# EAGLE schematic schematic (EAGLE 9.6.2)
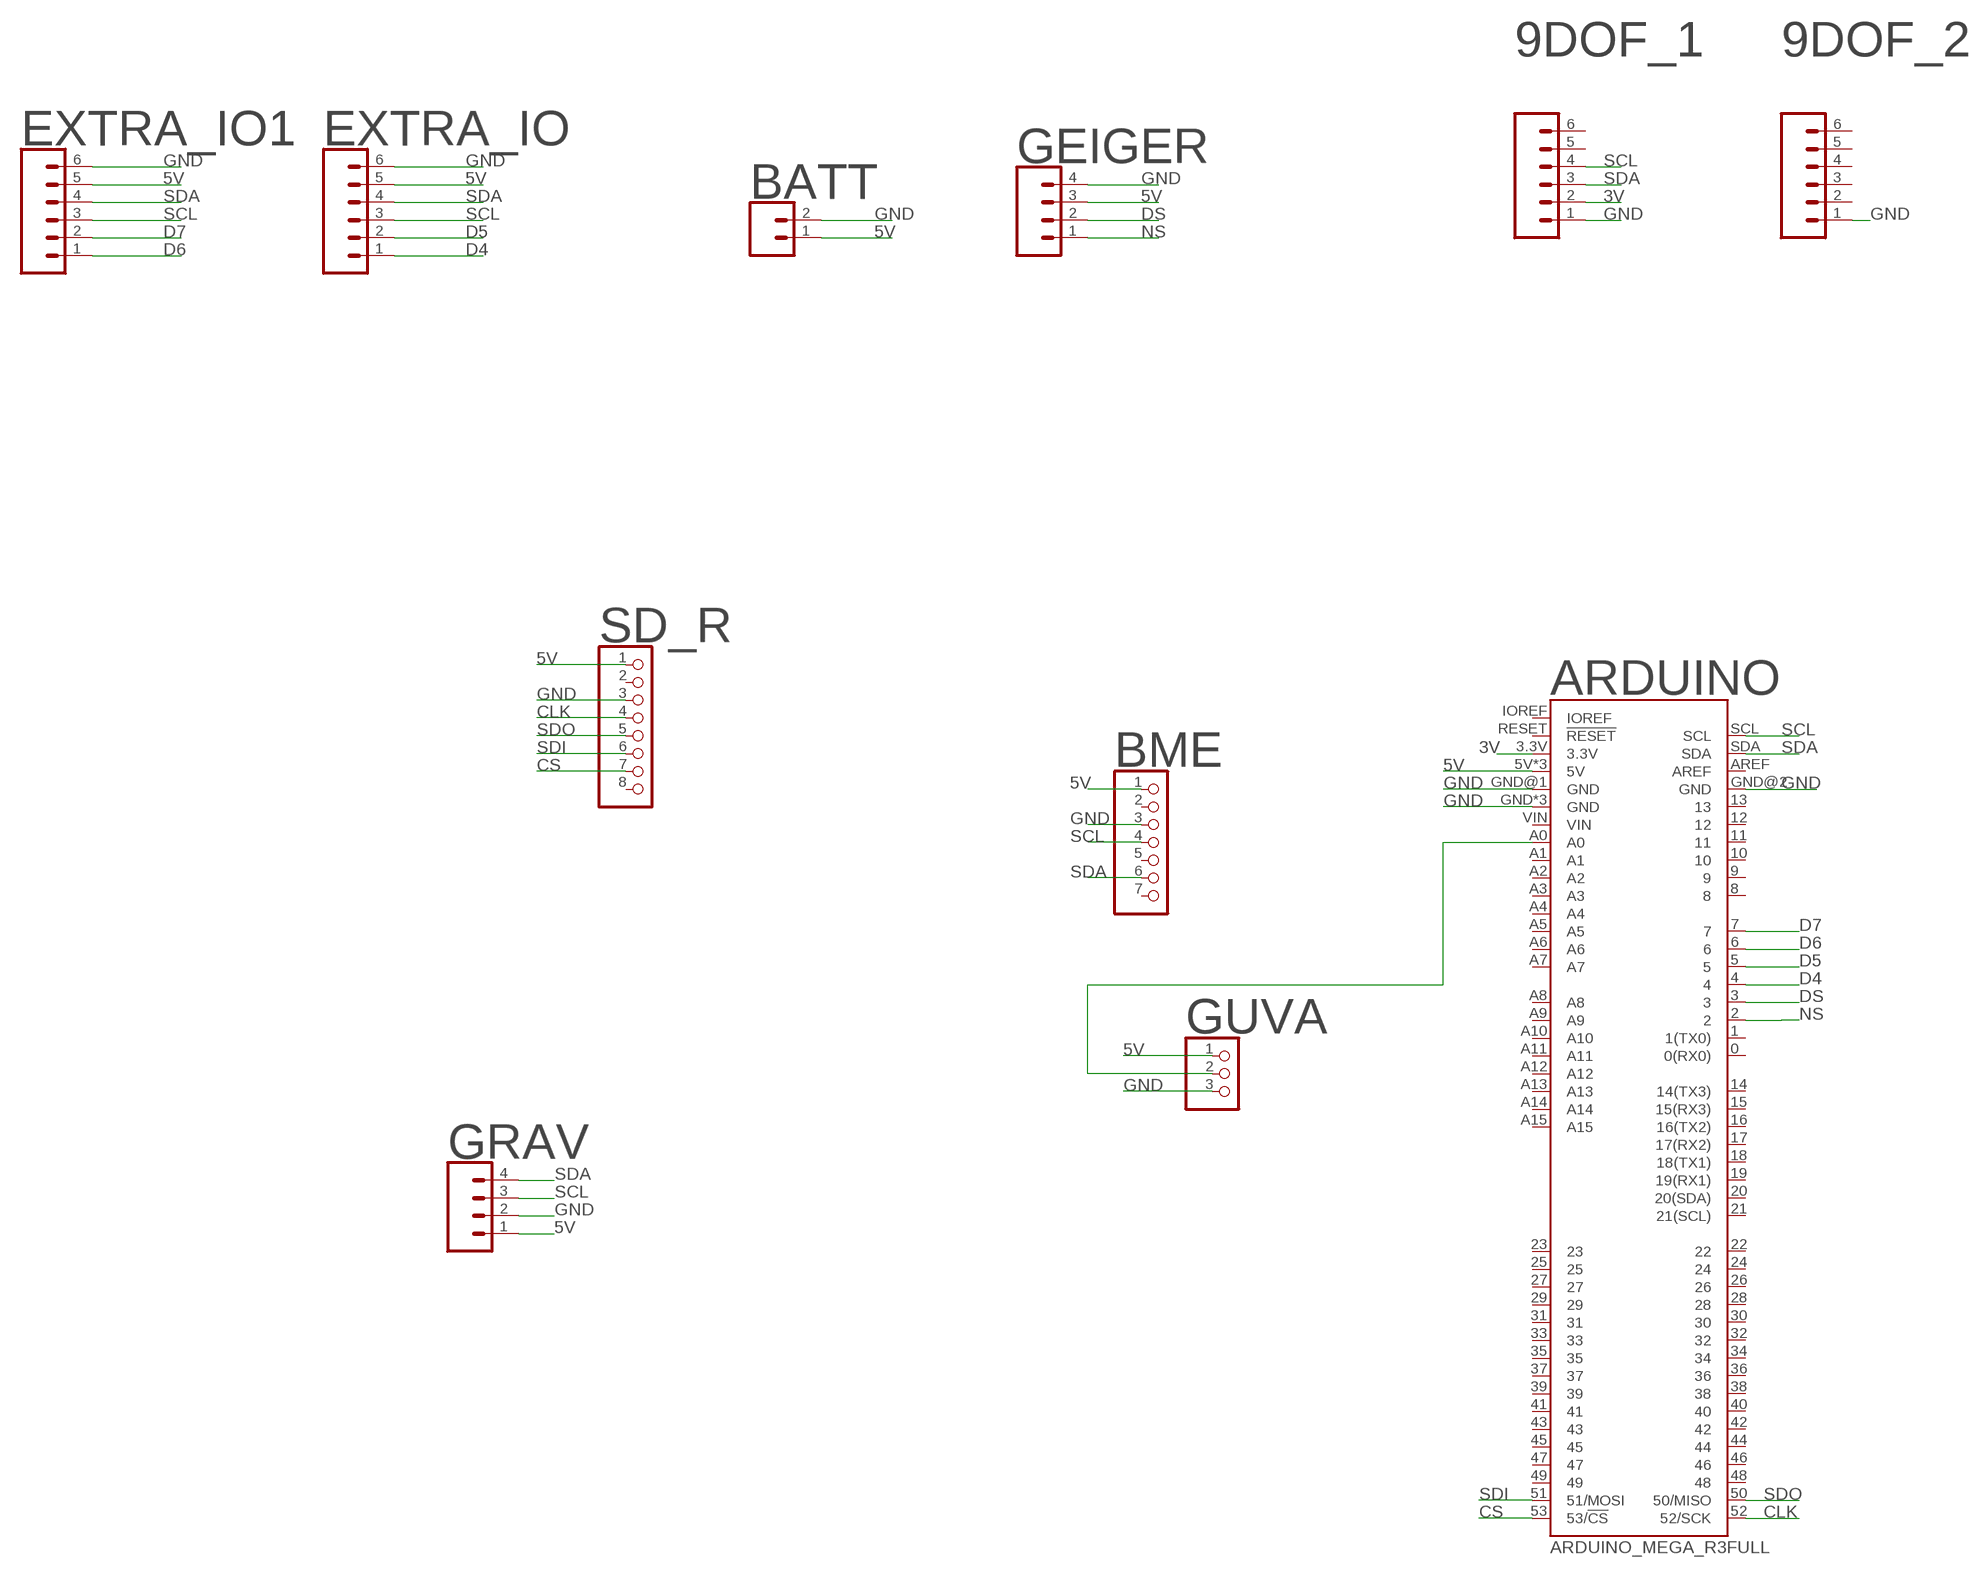
[diagram p0: schematic, sheet 1]

## Parts
9DOF_1  CONN_06NO_SILK_NO_POP  [1X06_NO_SILK]
9DOF_2  CONN_06NO_SILK_NO_POP  [1X06_NO_SILK]
ARDUINO  ARDUINO_MEGA_R3FULL  [ARDUINO_MEGA_NO_SILK]
BATT  CONN_02  [1X02]
BME  HEADER-1X770MIL  [1X07_ROUND_70]
EXTRA_IO  CONN_06SILK_FEMALE_PTH  [1X06]
EXTRA_IO1  CONN_06SILK_FEMALE_PTH  [1X06]
GEIGER  CONN_04PTH  [1X04]
GRAV  CONN_04LOCK  [1X04_LOCK]
GUVA  PINHD-1X3CB  [1X03-CLEANBIG]
SD_R  PINHD-1X8BIG  [1X08-BIG]

## Nets
3V: 9DOF_1.2 ARDUINO.3.3V
5V: ARDUINO.5V ARDUINO.5V@1(5V) ARDUINO.5V@2(5V) BATT.1 BME.1 EXTRA_IO1.5 EXTRA_IO.5 GEIGER.3 GRAV.1 GUVA.1 SD_R.1
CLK: ARDUINO.52(52/SCK) SD_R.4
CS: ARDUINO.53(53/!CS) SD_R.7
D4: ARDUINO.4 EXTRA_IO.1
D5: ARDUINO.5 EXTRA_IO.2
D6: ARDUINO.6 EXTRA_IO1.1
D7: ARDUINO.7 EXTRA_IO1.2
DS: ARDUINO.3 GEIGER.2
GND: 9DOF_1.1 9DOF_2.1 ARDUINO.GND ARDUINO.GND@1(GND) ARDUINO.GND@2(GND) ARDUINO.GND@3(GND) ARDUINO.GND@4(GND) BATT.2 BME.3 EXTRA_IO1.6 EXTRA_IO.6 GEIGER.4 GRAV.2 GUVA.3 SD_R.3
N$1: ARDUINO.A0 GUVA.2
NS: ARDUINO.2 GEIGER.1
SCL: 9DOF_1.4 ARDUINO.SCL BME.4 EXTRA_IO1.3 EXTRA_IO.3 GRAV.3
SDA: 9DOF_1.3 ARDUINO.SDA BME.6 EXTRA_IO1.4 EXTRA_IO.4 GRAV.4
SDI: ARDUINO.51(51/MOSI) SD_R.6
SDO: ARDUINO.50(50/MISO) SD_R.5
Unconnected: 9DOF_1.5 9DOF_1.6 9DOF_2.2 9DOF_2.3 9DOF_2.4 9DOF_2.5 9DOF_2.6 ARDUINO.0(0(RX0)) ARDUINO.1(1(TX0)) ARDUINO.8 ARDUINO.9 ARDUINO.10 ARDUINO.11 ARDUINO.12 ARDUINO.13 ARDUINO.14(14(TX3)) ARDUINO.15(15(RX3)) ARDUINO.16(16(TX2)) ARDUINO.17(17(RX2)) ARDUINO.18(18(TX1)) ARDUINO.19(19(RX1)) ARDUINO.20(20(SDA)) ARDUINO.21(21(SCL)) ARDUINO.22 ARDUINO.23 ARDUINO.24 ARDUINO.25 ARDUINO.26 ARDUINO.27 ARDUINO.28 ARDUINO.29 ARDUINO.30 ARDUINO.31 ARDUINO.32 ARDUINO.33 ARDUINO.34 ARDUINO.35 ARDUINO.36 ARDUINO.37 ARDUINO.38 ARDUINO.39 ARDUINO.40 ARDUINO.41 ARDUINO.42 ARDUINO.43 ARDUINO.44 ARDUINO.45 ARDUINO.46 ARDUINO.47 ARDUINO.48 ARDUINO.49 ARDUINO.A1 ARDUINO.A2 ARDUINO.A3 ARDUINO.A4 ARDUINO.A5 ARDUINO.A6 ARDUINO.A7 ARDUINO.A8 ARDUINO.A9 ARDUINO.A10 ARDUINO.A11 ARDUINO.A12 ARDUINO.A13 ARDUINO.A14 ARDUINO.A15 ARDUINO.AREF ARDUINO.IOREF ARDUINO.RESET(!RESET) ARDUINO.VIN BME.2 BME.5 BME.7 SD_R.2 SD_R.8

## Library data of the parts
9DOF_1 9DOF_2 = SparkFun-Connectors:CONN_06: Multi connection point. Often used as Generic Header-pin footprint for 0.1 inch spaced/style header connections On any of the 0.1 inch spaced packages, you can populate with these: Break Away Headers - Straight <https://www.sparkfun.com/products/116> (PRT-00116) Break Away Male Headers - Right Angle <https://www.sparkfun.com/products/553> (PRT-00553) Female Headers <https://www.sparkfun.com/products/115> (PRT-00115) Break Away Headers - Machine Pin <https://www.sparkfun.com/products/117> (PRT-00117) Break Away Female Headers - Swiss Machine Pin <https://www.sparkfun.com/products/743> (PRT-00743) Arduino Stackable Header - 6 Pin <https://www.sparkfun.com/products/9280> (PRT-09280) For SCREWTERMINALS and SPRING TERMINALS visit here: Screw Terimnals on SparkFun.com <https://www.sparkfun.com/search/results?term=Screw+Terminals> (5mm/3.5mm/2.54mm spacing) This device is also useful as a general connection point to wire up your design to another part of your project. Our various solder wires solder well into these plated through hole pads. Hook-Up Wire - Assortment (Stranded, 22 AWG) <https://www.sparkfun.com/products/11375> (PRT-11375) Hook-Up Wire - Assortment (Solid Core, 22 AWG) <https://www.sparkfun.com/products/11367> (PRT-11367) View the entire wire category on our website here <https://www.sparkfun.com/categories/141>
ARDUINO = SparkFun-Boards:ARDUINO_MEGA_R3: Arduino Mega R3 ATmega2560 R3 compatible footprint. SparkFun Products: Arduino Mega 2560 R3 <https://www.sparkfun.com/products/11061>
BATT = SparkFun-Connectors:CONN_02: Multi connection point. Often used as Generic Header-pin footprint for 0.1 inch spaced/style header connections On any of the 0.1 inch spaced packages, you can populate with these: Break Away Headers - Straight <https://www.sparkfun.com/products/116> (PRT-00116) Break Away Male Headers - Right Angle <https://www.sparkfun.com/products/553> (PRT-00553) Female Headers <https://www.sparkfun.com/products/115> (PRT-00115) Break Away Headers - Machine Pin <https://www.sparkfun.com/products/117> (PRT-00117) Break Away Female Headers - Swiss Machine Pin <https://www.sparkfun.com/products/743> (PRT-00743) For SCREWTERMINALS and SPRING TERMINALS visit here: Screw Terimnals on SparkFun.com <https://www.sparkfun.com/search/results?term=Screw+Terminals> (5mm/3.5mm/2.54mm spacing) This device is also useful as a general connection point to wire up your design to another part of your project. Our various solder wires solder well into these plated through hole pads. Hook-Up Wire - Assortment (Stranded, 22 AWG) <https://www.sparkfun.com/products/11375> (PRT-11375) Hook-Up Wire - Assortment (Solid Core, 22 AWG) <https://www.sparkfun.com/products/11367> (PRT-11367) View the entire wire category on our website here <https://www.sparkfun.com/categories/141> Special notes: Molex polarized connector foot print use with: PRT-08233 with associated crimp pins and housings. 2.54_SCREWTERM for use with PRT-10571. 3.5mm Screw Terminal footprints for PRT-08084 5mm Screw Terminal footprints for use with PRT-08432
BME = microbuilder:HEADER-1X7: PIN HEADER
EXTRA_IO EXTRA_IO1 = SparkFun-Connectors:CONN_06: Multi connection point. Often used as Generic Header-pin footprint for 0.1 inch spaced/style header connections On any of the 0.1 inch spaced packages, you can populate with these: Break Away Headers - Straight <https://www.sparkfun.com/products/116> (PRT-00116) Break Away Male Headers - Right Angle <https://www.sparkfun.com/products/553> (PRT-00553) Female Headers <https://www.sparkfun.com/products/115> (PRT-00115) Break Away Headers - Machine Pin <https://www.sparkfun.com/products/117> (PRT-00117) Break Away Female Headers - Swiss Machine Pin <https://www.sparkfun.com/products/743> (PRT-00743) Arduino Stackable Header - 6 Pin <https://www.sparkfun.com/products/9280> (PRT-09280) For SCREWTERMINALS and SPRING TERMINALS visit here: Screw Terimnals on SparkFun.com <https://www.sparkfun.com/search/results?term=Screw+Terminals> (5mm/3.5mm/2.54mm spacing) This device is also useful as a general connection point to wire up your design to another part of your project. Our various solder wires solder well into these plated through hole pads. Hook-Up Wire - Assortment (Stranded, 22 AWG) <https://www.sparkfun.com/products/11375> (PRT-11375) Hook-Up Wire - Assortment (Solid Core, 22 AWG) <https://www.sparkfun.com/products/11367> (PRT-11367) View the entire wire category on our website here <https://www.sparkfun.com/categories/141>; PROD_ID: CONN-08437
GEIGER GRAV = SparkFun-Connectors:CONN_04: Multi connection point. Often used as Generic Header-pin footprint for 0.1 inch spaced/style header connections On any of the 0.1 inch spaced packages, you can populate with these: Break Away Headers - Straight <https://www.sparkfun.com/products/116> (PRT-00116) Break Away Male Headers - Right Angle <https://www.sparkfun.com/products/553> (PRT-00553) Female Headers <https://www.sparkfun.com/products/115> (PRT-00115) Break Away Headers - Machine Pin <https://www.sparkfun.com/products/117> (PRT-00117) Break Away Female Headers - Swiss Machine Pin <https://www.sparkfun.com/products/743> (PRT-00743) For SCREWTERMINALS and SPRING TERMINALS visit here: Screw Terimnals on SparkFun.com <https://www.sparkfun.com/search/results?term=Screw+Terminals> (5mm/3.5mm/2.54mm spacing) This device is also useful as a general connection point to wire up your design to another part of your project. Our various solder wires solder well into these plated through hole pads. Hook-Up Wire - Assortment (Stranded, 22 AWG) <https://www.sparkfun.com/products/11375> (PRT-11375) Hook-Up Wire - Assortment (Solid Core, 22 AWG) <https://www.sparkfun.com/products/11367> (PRT-11367) View the entire wire category on our website here <https://www.sparkfun.com/categories/141> Special notes: Molex polarized connector foot print use with SKU : PRT-08231 with associated crimp pins and housings. 1MM SMD Version SKU: PRT-10208; PROD_ID: CONN-09696
GUVA = adafruit:PINHD-1X3: PIN HEADER
SD_R = adafruit:PINHD-1X8: PIN HEADER

## Net classes
1 highpower: width 0.305 mm, drill 0.483 mm
2 lowpower: width 0.305 mm, drill 0.483 mm
3 power usb: width 0.508 mm, drill 0.406 mm, clearance 0.203 mm